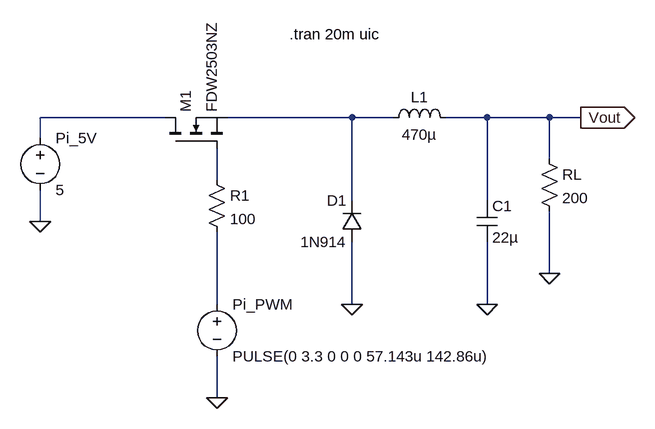
[diagram p0: schematic Power_Reg_Circuit.asc]
Power_Reg_Circuit.asc, the LTspice schematic file:
Version 4
SHEET 1 1732 864
WIRE 992 416 800 416
WIRE 1280 416 1088 416
WIRE 1344 416 1280 416
WIRE 1488 416 1424 416
WIRE 1584 416 1488 416
WIRE 1632 416 1584 416
WIRE 800 448 800 416
WIRE 1584 480 1584 416
WIRE 1072 512 1072 464
WIRE 1280 544 1280 416
WIRE 1488 544 1488 416
WIRE 800 576 800 528
WIRE 1584 656 1584 560
WIRE 1072 704 1072 592
WIRE 1280 704 1280 608
WIRE 1488 704 1488 608
WIRE 1072 848 1072 784
FLAG 1632 416 Vout
IOPIN 1632 416 Out
FLAG 1280 704 0
FLAG 1488 704 0
FLAG 800 576 0
FLAG 1072 848 0
FLAG 1584 656 0
SYMBOL nmos 992 464 R270
SYMATTR InstName M1
SYMATTR Value FDW2503NZ
SYMBOL ind 1328 432 R270
WINDOW 0 32 56 VTop 2
WINDOW 3 5 56 VBottom 2
SYMATTR InstName L1
SYMATTR Value 470µ
SYMATTR SpiceLine Ipk=620m Rser=1.15 Rpar=347.989K Cpar=0 mfg="Bourns, Inc." pn="SRR0908-471YL"
SYMBOL cap 1472 544 R0
WINDOW 3 24 57 Left 2
SYMATTR Value 22µ
SYMATTR InstName C1
SYMATTR Description Polarized Capacitor
SYMATTR Type polcap
SYMATTR SpiceLine V=226M006ATE028 Rser=0 Lser=0 mfg="Murata" pn="GRM188R60G226MEA0" type="X5R"
SYMBOL diode 1296 608 R180
WINDOW 0 24 64 Left 2
WINDOW 3 24 0 Left 2
SYMATTR InstName D1
SYMATTR Value 1N914
SYMBOL res 1056 496 R0
SYMATTR InstName R1
SYMATTR Value 100
SYMBOL voltage 800 432 R0
SYMATTR InstName Pi_5V
SYMATTR Value 5
SYMBOL voltage 1072 688 R0
SYMATTR InstName Pi_PWM
SYMATTR Value PULSE(0 3.3 0 0 0 57.143u 142.86u)
SYMBOL res 1568 464 R0
SYMATTR InstName RL
SYMATTR Value 200
TEXT 1184 288 Left 2 !.tran 20m uic

The netlist it stands for:
* Power_Reg_Circuit.asc
M1 N001 N003 N002 N002 FDW2503NZ
L1 N002 Vout 470µ Ipk=620m Rser=1.15 Rpar=347.989K Cpar=0 mfg="Bourns, Inc." pn="SRR0908-471YL"
C1 Vout 0 22µ V=226M006ATE028 Rser=0 Lser=0 mfg="Murata" pn="GRM188R60G226MEA0" type="X5R"
D1 0 N002 1N914
R1 N003 N004 100
V§Pi_5V N001 0 5
V§Pi_PWM N004 0 PULSE(0 3.3 0 0 0 57.143u 142.86u)
RL Vout 0 200
.model D D
.lib standard.dio
.model NMOS NMOS
.model PMOS PMOS
.lib standard.mos
.tran 20m uic
.backanno
.end